# EAGLE design yarns_v03 (EAGLE 7.7.0)

## Sheet 1 of 3
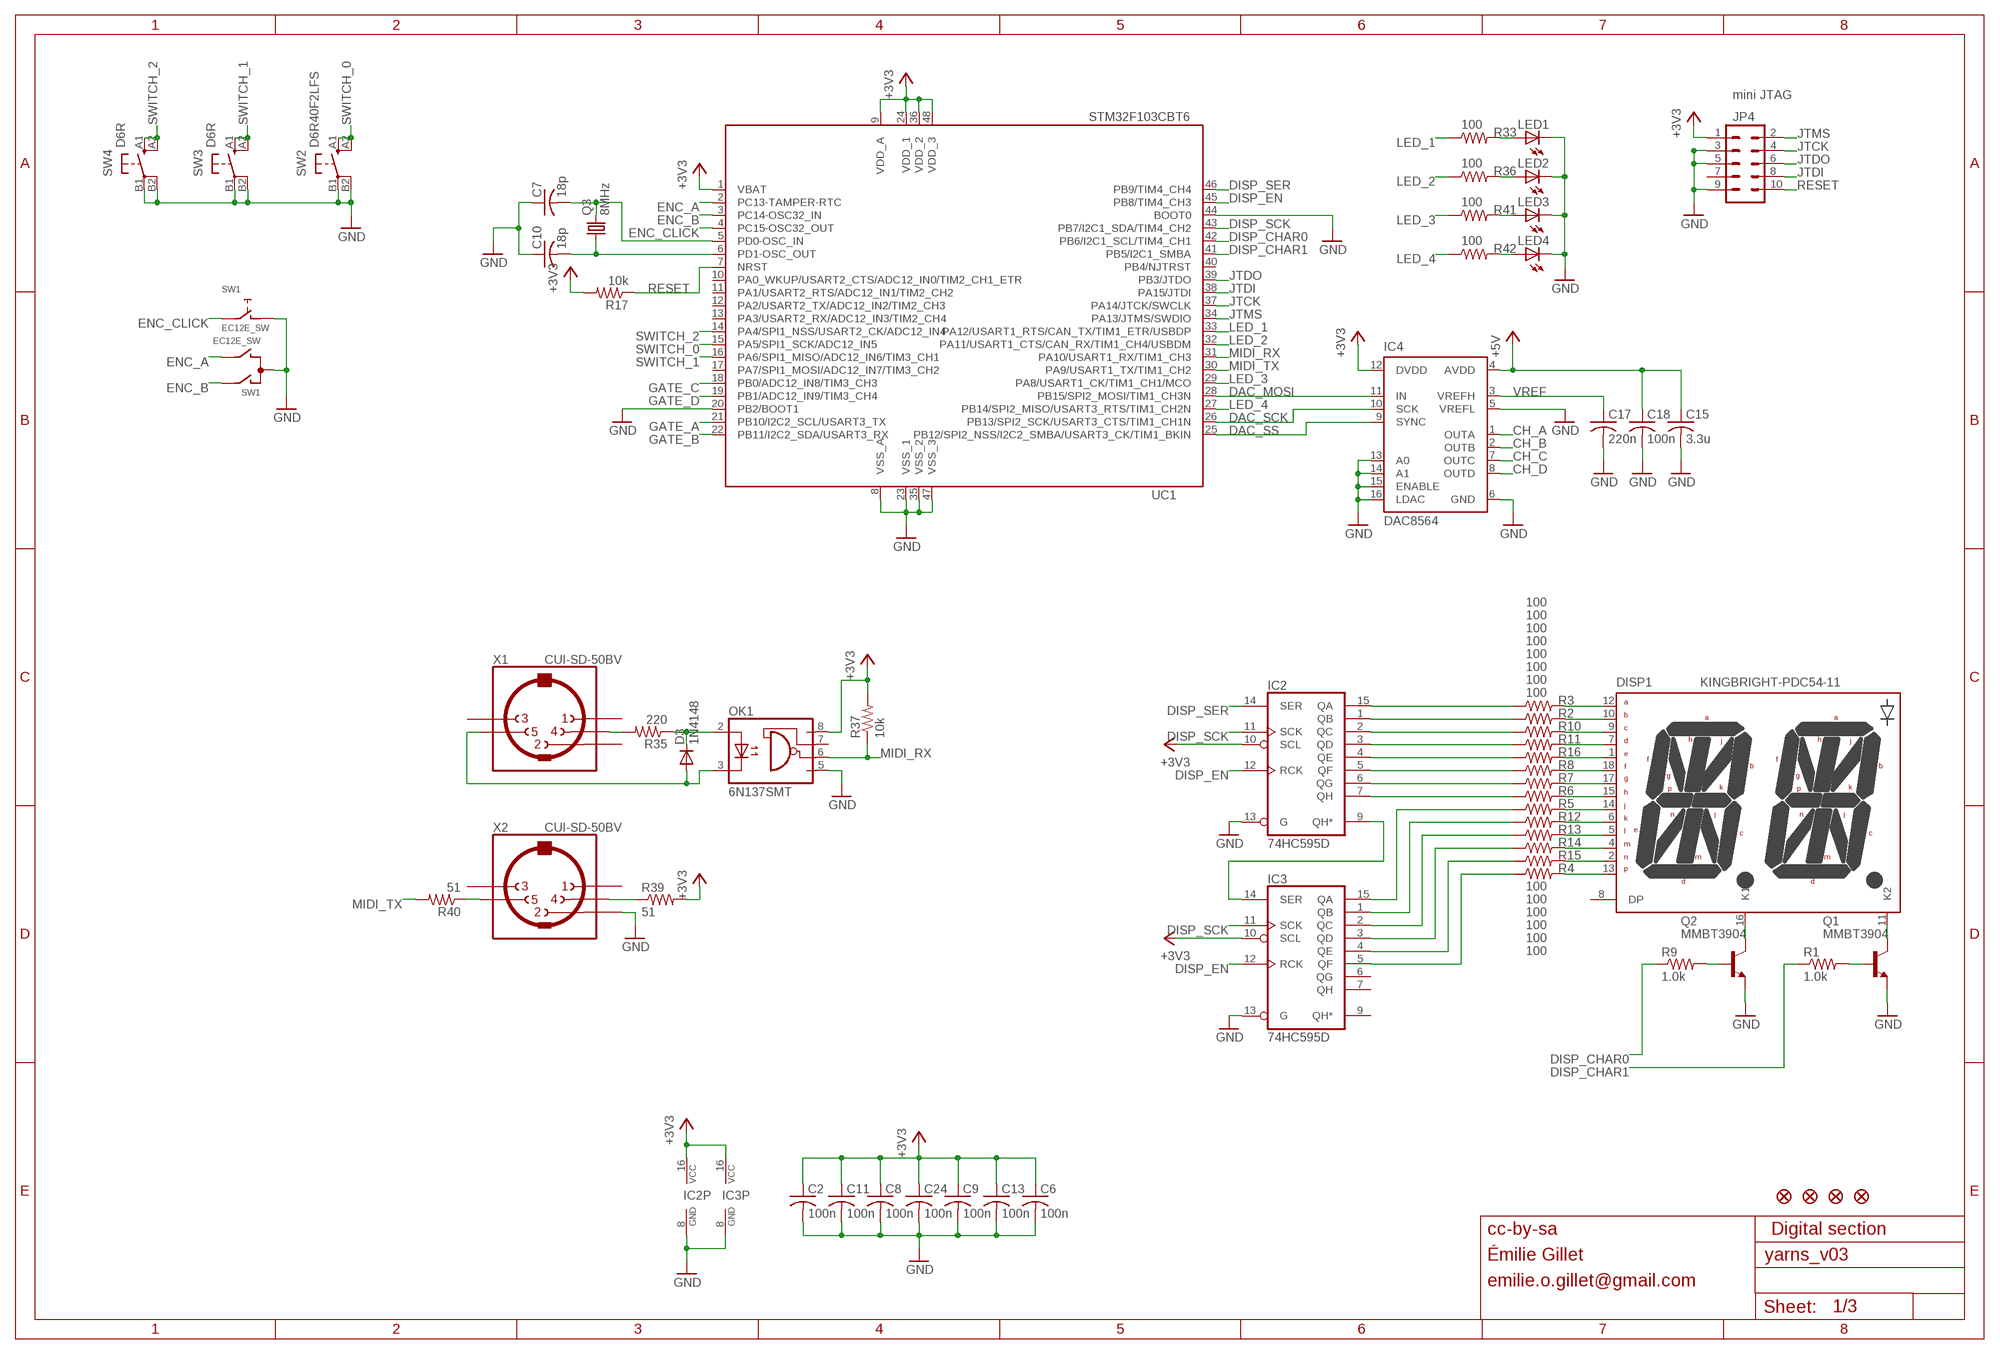
[diagram p0: schematic, sheet 1]

### Parts
C2  100n  C-USC0603  [C0603]
C6  100n  C-USC0603  [C0603]
C7  18p  C-USC0603  [C0603]
C8  100n  C-USC0603  [C0603]
C9  100n  C-USC0603  [C0603]
C10  18p  C-USC0603  [C0603]
C11  100n  C-USC0603  [C0603]
C13  100n  C-USC0603  [C0603]
C15  3.3u  C-USC0603  [C0603]
C17  220n  C-USC0603  [C0603]
C18  100n  C-USC0603  [C0603]
C24  100n  C-USC0603  [C0603]
D3  1N4148  DIODE-SOD323-W  [SOD323-W]
DISP1  KINGBRIGHT-PDC54-11  [PDC54]
F1  FIDUCIAL1X2  [FIDUCIAL-1X2]
F3  FIDUCIAL1X2  [FIDUCIAL-1X2]
F5  FIDUCIAL1X2  [FIDUCIAL-1X2]
F6  FIDUCIAL1X2  [FIDUCIAL-1X2]
IC2  74HC595D  [SO16]
IC3  74HC595D  [SO16]
IC4  DAC8564  [SOP65P640X110-16N]
JP4  M05X2MINIJTAG  [2X5-1.27]
LED1  LED3MM  [LED3MM]
LED2  LED3MM  [LED3MM]
LED3  LED3MM  [LED3MM]
LED4  LED3MM  [LED3MM]
OK1  6N137SMT  [DIL8-SMD]
Q1  MMBT3904  MMBT3904LT1-NPN-SOT23-BEC  [SOT23-BEC]
Q2  MMBT3904  MMBT3904LT1-NPN-SOT23-BEC  [SOT23-BEC]
Q3  8MHz  CRYSTALHC49UP  [HC49UP]
R1  1.0k  R-US_R0603  [R0603]
R2  100  R-US_R0603  [R0603]
R3  100  R-US_R0603  [R0603]
R4  100  R-US_R0603  [R0603]
R5  100  R-US_R0603  [R0603]
R6  100  R-US_R0603  [R0603]
R7  100  R-US_R0603  [R0603]
R8  100  R-US_R0603  [R0603]
R9  1.0k  R-US_R0603  [R0603]
R10  100  R-US_R0603  [R0603]
R11  100  R-US_R0603  [R0603]
R12  100  R-US_R0603  [R0603]
R13  100  R-US_R0603  [R0603]
R14  100  R-US_R0603  [R0603]
R15  100  R-US_R0603  [R0603]
R16  100  R-US_R0603  [R0603]
R17  10k  R-US_R0603  [R0603]
R33  100  R-US_R0603  [R0603]
R35  220  R-US_R0603  [R0603]
R36  100  R-US_R0603  [R0603]
R37  10k  R-US_R0603  [R0603]
R39  51  R-US_R0603  [R0603]
R40  51  R-US_R0603  [R0603]
R41  100  R-US_R0603  [R0603]
R42  100  R-US_R0603  [R0603]
SW1  EC12E_SW  [ALPS_EC12E_SW]
SW2  D6R40F2LFS  D6R  [D6R]
SW3  D6R  [D6R]
SW4  D6R  [D6R]
UC1  STM32F103CBT6  STM32F103CB  [LQFP48]
X1  CUI-SD-50BV  MAB5SHCUI-SD-50BV  [SD-50BV]
X2  CUI-SD-50BV  MAB5SHCUI-SD-50BV  [SD-50BV]

### Nets
+3V3: C2.1 C6.1 C8.1 C9.1 C11.1 C13.1 C24.1 IC2.10(SCL) IC2.16(VCC) IC3.10(SCL) IC3.16(VCC) IC4.12(DVDD) JP4.1 OK1.8(VCC) R17.2 R37.2 R39.2 UC1.1(VBAT) UC1.9(VDD_A) UC1.24(VDD_1) UC1.36(VDD_2) UC1.48(VDD_3) ; also sheet 3
+5V: C15.1 C18.1 IC4.4(AVDD) ; also sheet 3
CH_A: IC4.1(OUTA) ; also sheet 2
CH_B: IC4.2(OUTB) ; also sheet 2
CH_C: IC4.7(OUTC) ; also sheet 2
CH_D: IC4.8(OUTD) ; also sheet 2
DAC_MOSI: IC4.11(IN) UC1.28(PB15/SPI2_MOSI/TIM1_CH3N)
DAC_SCK: IC4.10(SCK) UC1.26(PB13/SPI2_SCK/USART3_CTS/TIM1_CH1N)
DAC_SS: IC4.9(SYNC) UC1.25(PB12/SPI2_NSS/I2C2_SMBA/USART3_CK/TIM1_BKIN)
DISP_CHAR0: R9.1 UC1.42(PB6/I2C1_SCL/TIM4_CH1)
DISP_CHAR1: R1.1 UC1.41(PB5/I2C1_SMBA)
DISP_EN: IC2.12(RCK) IC3.12(RCK) UC1.45(PB8/TIM4_CH3)
DISP_SCK: IC2.11(SCK) IC3.11(SCK) UC1.43(PB7/I2C1_SDA/TIM4_CH2)
DISP_SER: IC2.14(SER) UC1.46(PB9/TIM4_CH4)
ENC_A: SW1.B UC1.2(PC13-TAMPER-RTC)
ENC_B: SW1.A UC1.3(PC14-OSC32_IN)
ENC_CLICK: SW1.E UC1.4(PC15-OSC32_OUT)
GATE_A: UC1.21(PB10/I2C2_SCL/USART3_TX) ; also sheet 2
GATE_B: UC1.22(PB11/I2C2_SDA/USART3_RX) ; also sheet 2
GATE_C: UC1.18(PB0/ADC12_IN8/TIM3_CH3) ; also sheet 2
GATE_D: UC1.19(PB1/ADC12_IN9/TIM3_CH4) ; also sheet 2
GND: C2.2 C6.2 C7.1 C8.2 C9.2 C10.1 C11.2 C13.2 C15.2 C17.2 C18.2 C24.2 IC2.8(GND) IC2.13(G) IC3.8(GND) IC3.13(G) IC4.5(VREFL) IC4.6(GND) IC4.13(A0) IC4.14(A1) IC4.15(ENABLE) IC4.16(LDAC) JP4.3 JP4.5 JP4.9 LED1.K(C) LED2.K(C) LED3.K(C) LED4.K(C) OK1.5(GND) Q1.E Q2.E SW1.C SW1.D SW2.B1(P) SW2.B2(P1) SW3.B1(P) SW3.B2(P1) SW4.B1(P) SW4.B2(P1) UC1.8(VSS_A) UC1.20(PB2/BOOT1) UC1.23(VSS_1) UC1.35(VSS_2) UC1.44(BOOT0) UC1.47(VSS_3) X2.2 ; also sheet 2,3
JTCK: JP4.4 UC1.37(PA14/JTCK/SWCLK)
JTDI: JP4.8 UC1.38(PA15/JTDI)
JTDO: JP4.6 UC1.39(PB3/JTDO)
JTMS: JP4.2 UC1.34(PA13/JTMS/SWDIO)
LED_1: R33.1 UC1.33(PA12/USART1_RTS/CAN_TX/TIM1_ETR/USBDP)
LED_2: R36.1 UC1.32(PA11/USART1_CTS/CAN_RX/TIM1_CH4/USBDM)
LED_3: R41.1 UC1.29(PA8/USART1_CK/TIM1_CH1/MCO)
LED_4: R42.1 UC1.27(PB14/SPI2_MISO/USART3_RTS/TIM1_CH2N)
MIDI_RX: OK1.6(VO) R37.1 UC1.31(PA10/USART1_RX/TIM1_CH3)
MIDI_TX: R40.2 UC1.30(PA9/USART1_TX/TIM1_CH2)
N$1: DISP1.16(K1) Q2.C
N$3: DISP1.11(K2) Q1.C
N$4: C7.2 Q3.2 UC1.5(PD0-OSC_IN)
N$5: C10.2 Q3.1 UC1.6(PD1-OSC_OUT)
N$6: Q2.B R9.2
N$7: Q1.B R1.2
N$8: D3.C OK1.2(A) R35.1
N$9: R35.2 X1.4
N$10: R40.1 X2.5
N$11: DISP1.17(G) R7.2
N$12: D3.A OK1.3(C) X1.5
N$13: R39.1 X2.4
N$15: DISP1.12(A) R3.2
N$16: DISP1.10(B) R2.2
N$17: DISP1.9(C) R10.2
N$18: DISP1.7(D) R11.2
N$19: DISP1.1(E) R16.2
N$20: DISP1.18(F) R8.2
N$22: DISP1.15(H) R6.2
N$23: DISP1.14(J) R5.2
N$24: DISP1.6(K) R12.2
N$25: DISP1.5(L) R13.2
N$26: DISP1.4(M) R14.2
N$27: DISP1.2(N) R15.2
N$28: DISP1.13(P) R4.2
N$30: IC2.7(QH) R6.1
N$31: IC2.9(QH*) IC3.14(SER)
N$32: IC2.15(QA) R3.1
N$33: IC2.1(QB) R2.1
N$34: IC2.2(QC) R10.1
N$35: IC2.3(QD) R11.1
N$36: IC2.4(QE) R16.1
N$37: IC2.5(QF) R8.1
N$38: IC2.6(QG) R7.1
N$39: IC3.15(QA) R5.1
N$40: IC3.1(QB) R12.1
N$41: IC3.2(QC) R13.1
N$42: IC3.3(QD) R14.1
N$43: IC3.4(QE) R15.1
N$44: IC3.5(QF) R4.1
N$54: LED1.A R33.2
N$65: LED2.A R36.2
N$66: LED3.A R41.2
N$67: LED4.A R42.2
RESET: JP4.10 R17.1 UC1.7(NRST)
SWITCH_0: SW2.A1(S) SW2.A2(S1) UC1.15(PA5/SPI1_SCK/ADC12_IN5)
SWITCH_1: SW3.A1(S) SW3.A2(S1) UC1.16(PA6/SPI1_MISO/ADC12_IN6/TIM3_CH1)
SWITCH_2: SW4.A1(S) SW4.A2(S1) UC1.14(PA4/SPI1_NSS/USART2_CK/ADC12_IN4)
VREF: C17.1 IC4.3(VREFH) ; also sheet 2
Unconnected: DISP1.8(DP) IC3.6(QG) IC3.7(QH) IC3.9(QH*) JP4.7 OK1.7(VE) SW1.GND1(G) SW1.GND2(G) UC1.10(PA0_WKUP/USART2_CTS/ADC12_IN0/TIM2_CH1_ETR) UC1.11(PA1/USART2_RTS/ADC12_IN1/TIM2_CH2) UC1.12(PA2/USART2_TX/ADC12_IN2/TIM2_CH3) UC1.13(PA3/USART2_RX/ADC12_IN3/TIM2_CH4) UC1.17(PA7/SPI1_MOSI/ADC12_IN7/TIM3_CH2) UC1.40(PB4/NJTRST) X1.1 X1.2 X1.3 X2.1 X2.3

### Notes on the sheet
- mini JTAG
- cc-by-sa | Digital section
- Émilie Gillet
- emilie.o.gillet@gmail.com

## Sheet 2 of 3
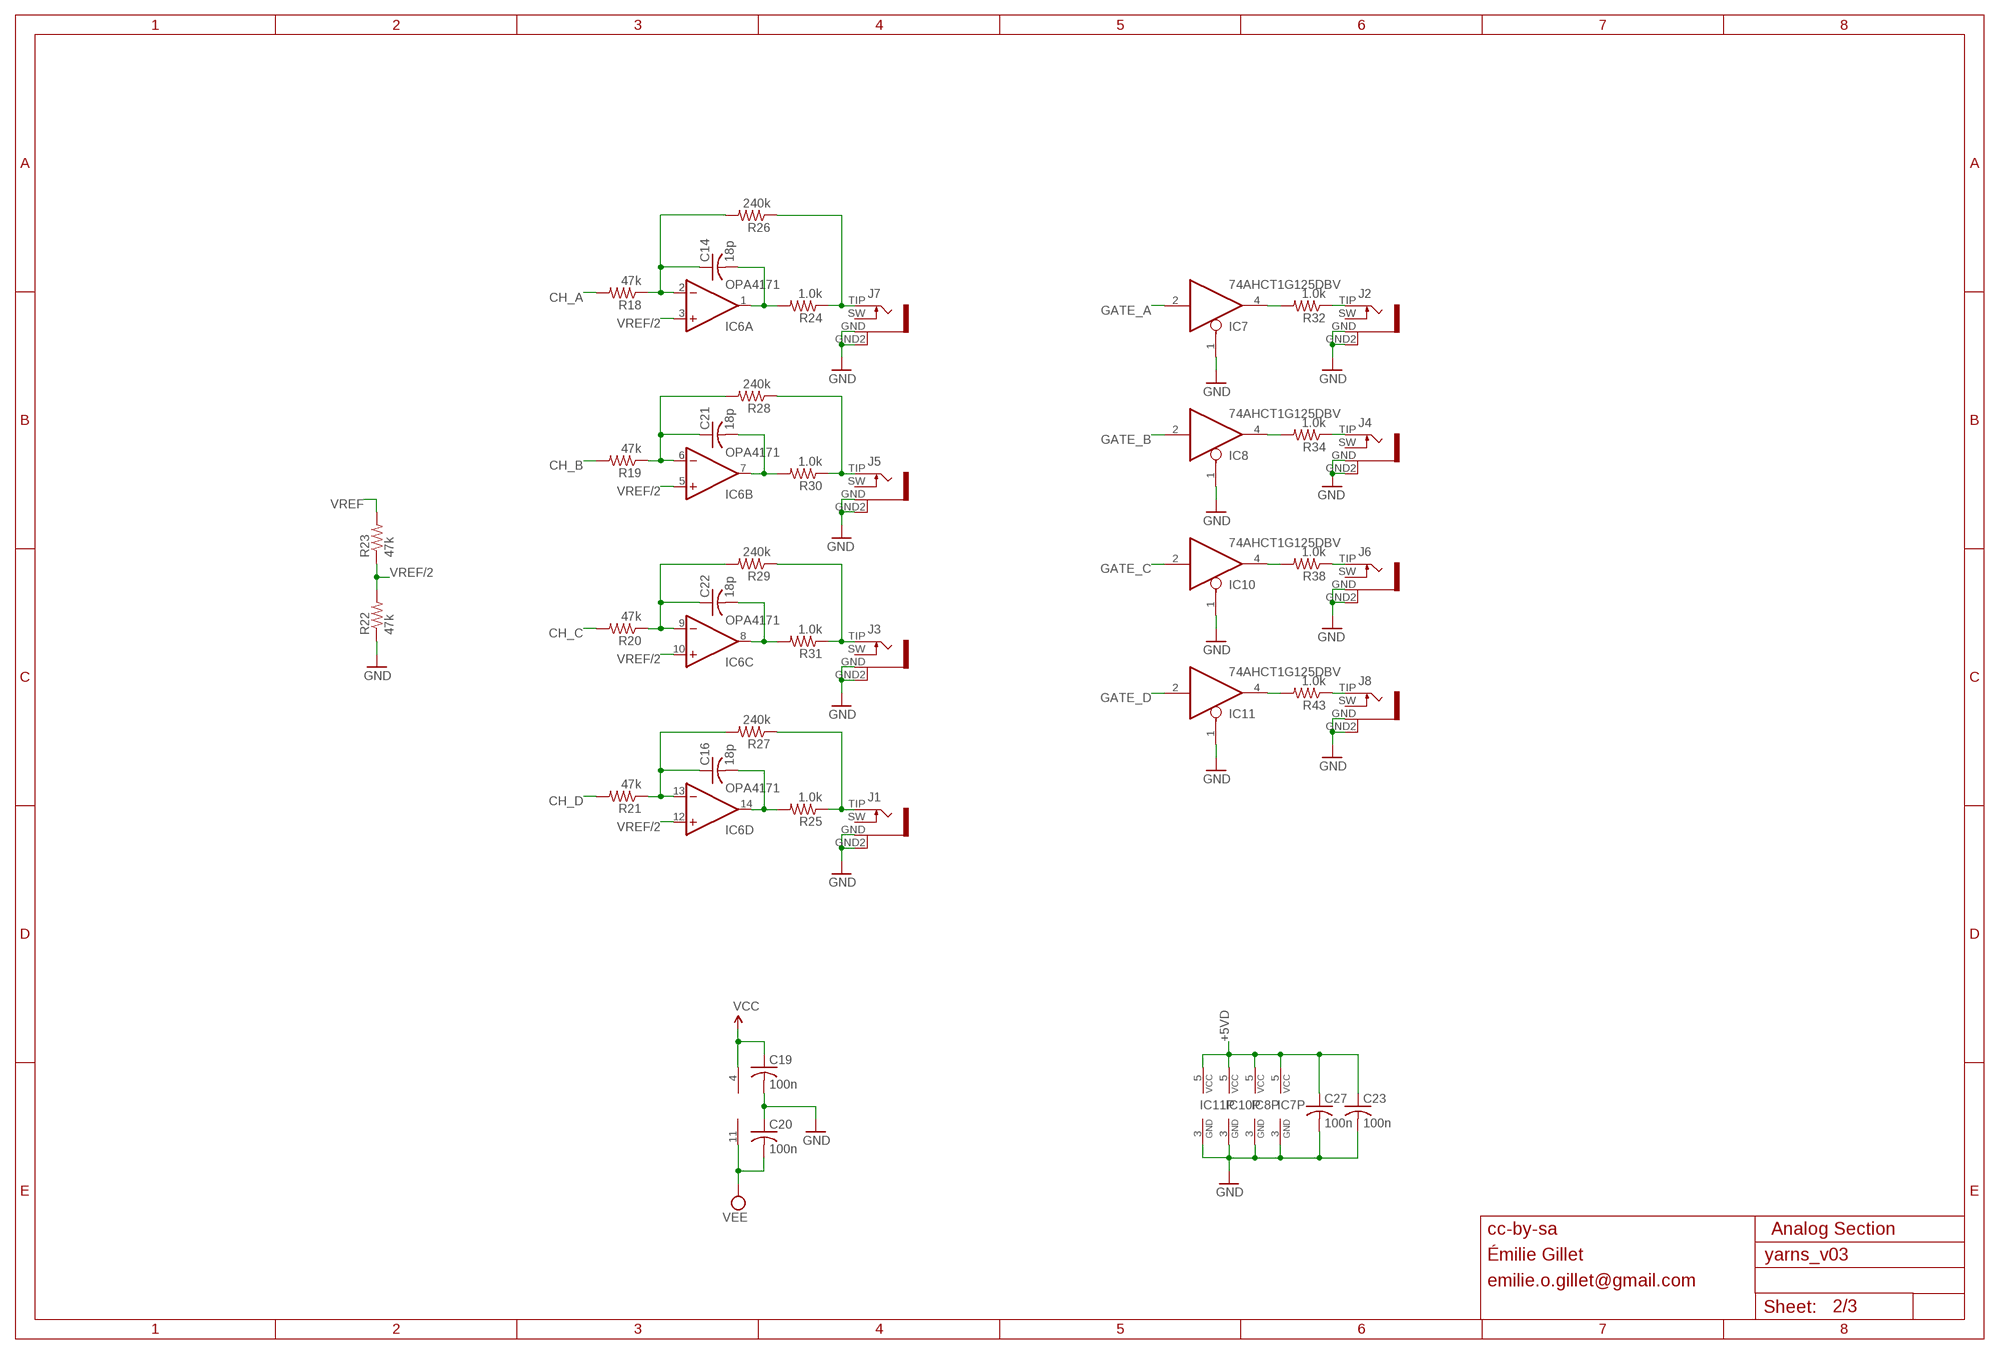
[diagram p1: schematic, sheet 2]

### Parts
C14  18p  C-USC0603  [C0603]
C16  18p  C-USC0603  [C0603]
C19  100n  C-USC0603  [C0603]
C20  100n  C-USC0603  [C0603]
C21  18p  C-USC0603  [C0603]
C22  18p  C-USC0603  [C0603]
C23  100n  C-USC0603  [C0603]
C27  100n  C-USC0603  [C0603]
IC6  OPA4171  TL074D  [SO14]
IC7  74AHCT1G125DBV  [SOT23-5]
IC8  74AHCT1G125DBV  [SOT23-5]
IC10  74AHCT1G125DBV  [SOT23-5]
IC11  74AHCT1G125DBV  [SOT23-5]
J1  PJ301WQP  [WQP_PJ_301BM]
J2  PJ301WQP  [WQP_PJ_301BM]
J3  PJ301WQP  [WQP_PJ_301BM]
J4  PJ301WQP  [WQP_PJ_301BM]
J5  PJ301WQP  [WQP_PJ_301BM]
J6  PJ301WQP  [WQP_PJ_301BM]
J7  PJ301WQP  [WQP_PJ_301BM]
J8  PJ301WQP  [WQP_PJ_301BM]
R18  47k  R-US_R0603  [R0603]
R19  47k  R-US_R0603  [R0603]
R20  47k  R-US_R0603  [R0603]
R21  47k  R-US_R0603  [R0603]
R22  47k  R-US_R0603  [R0603]
R23  47k  R-US_R0603  [R0603]
R24  1.0k  R-US_R0603  [R0603]
R25  1.0k  R-US_R0603  [R0603]
R26  240k  R-US_R0603  [R0603]
R27  240k  R-US_R0603  [R0603]
R28  240k  R-US_R0603  [R0603]
R29  240k  R-US_R0603  [R0603]
R30  1.0k  R-US_R0603  [R0603]
R31  1.0k  R-US_R0603  [R0603]
R32  1.0k  R-US_R0603  [R0603]
R34  1.0k  R-US_R0603  [R0603]
R38  1.0k  R-US_R0603  [R0603]
R43  1.0k  R-US_R0603  [R0603]

### Nets
+5VD: C23.1 C27.1 IC7.5(VCC) IC8.5(VCC) IC10.5(VCC) IC11.5(VCC) ; also sheet 3
AOUT: J2.TIP R32.1
CH_A: R18.2 ; also sheet 1
CH_B: R19.2 ; also sheet 1
CH_C: R20.2 ; also sheet 1
CH_D: R21.2 ; also sheet 1
GATE_A: IC7.2(I) ; also sheet 1
GATE_B: IC8.2(I) ; also sheet 1
GATE_C: IC10.2(I) ; also sheet 1
GATE_D: IC11.2(I) ; also sheet 1
GND: C19.2 C20.1 C23.2 C27.2 IC7.1(OE) IC7.3(GND) IC8.1(OE) IC8.3(GND) IC10.1(OE) IC10.3(GND) IC11.1(OE) IC11.3(GND) J1.GND J1.GND2 J2.GND J2.GND2 J3.GND J3.GND2 J4.GND J4.GND2 J5.GND J5.GND2 J6.GND J6.GND2 J7.GND J7.GND2 J8.GND J8.GND2 R22.1 ; also sheet 1,3
N$2: C22.1 IC6.9(C:-IN) R20.1 R29.2
N$14: IC7.4(O) R32.2
N$29: IC8.4(O) R34.2
N$45: IC10.4(O) R38.2
N$46: IC11.4(O) R43.2
N$47: C14.2 IC6.1(A:OUT) R24.2
N$48: J6.TIP R38.1
N$49: J8.TIP R43.1
N$50: C21.2 IC6.7(B:OUT) R30.2
N$51: C22.2 IC6.8(C:OUT) R31.2
N$52: C16.2 IC6.14(D:OUT) R25.2
N$53: J7.TIP R24.1 R26.1
N$55: J3.TIP R29.1 R31.1
N$57: J4.TIP R34.1
N$58: J1.TIP R25.1 R27.1
N$59: C16.1 IC6.13(D:-IN) R21.1 R27.2
N$60: C21.1 IC6.6(B:-IN) R19.1 R28.2
N$61: C14.1 IC6.2(A:-IN) R18.1 R26.2
N$63: J5.TIP R28.1 R30.1
VCC: C19.1 IC6.4(P:V+) ; also sheet 3
VEE: C20.2 IC6.11(P:V-) ; also sheet 3
VREF: R23.2 ; also sheet 1
VREF/2: IC6.3(A:+IN) IC6.5(B:+IN) IC6.10(C:+IN) IC6.12(D:+IN) R22.2 R23.1
Unconnected: J1.SW J2.SW J3.SW J4.SW J5.SW J6.SW J7.SW J8.SW

### Notes on the sheet
- cc-by-sa | Analog Section
- Émilie Gillet
- emilie.o.gillet@gmail.com

## Sheet 3 of 3
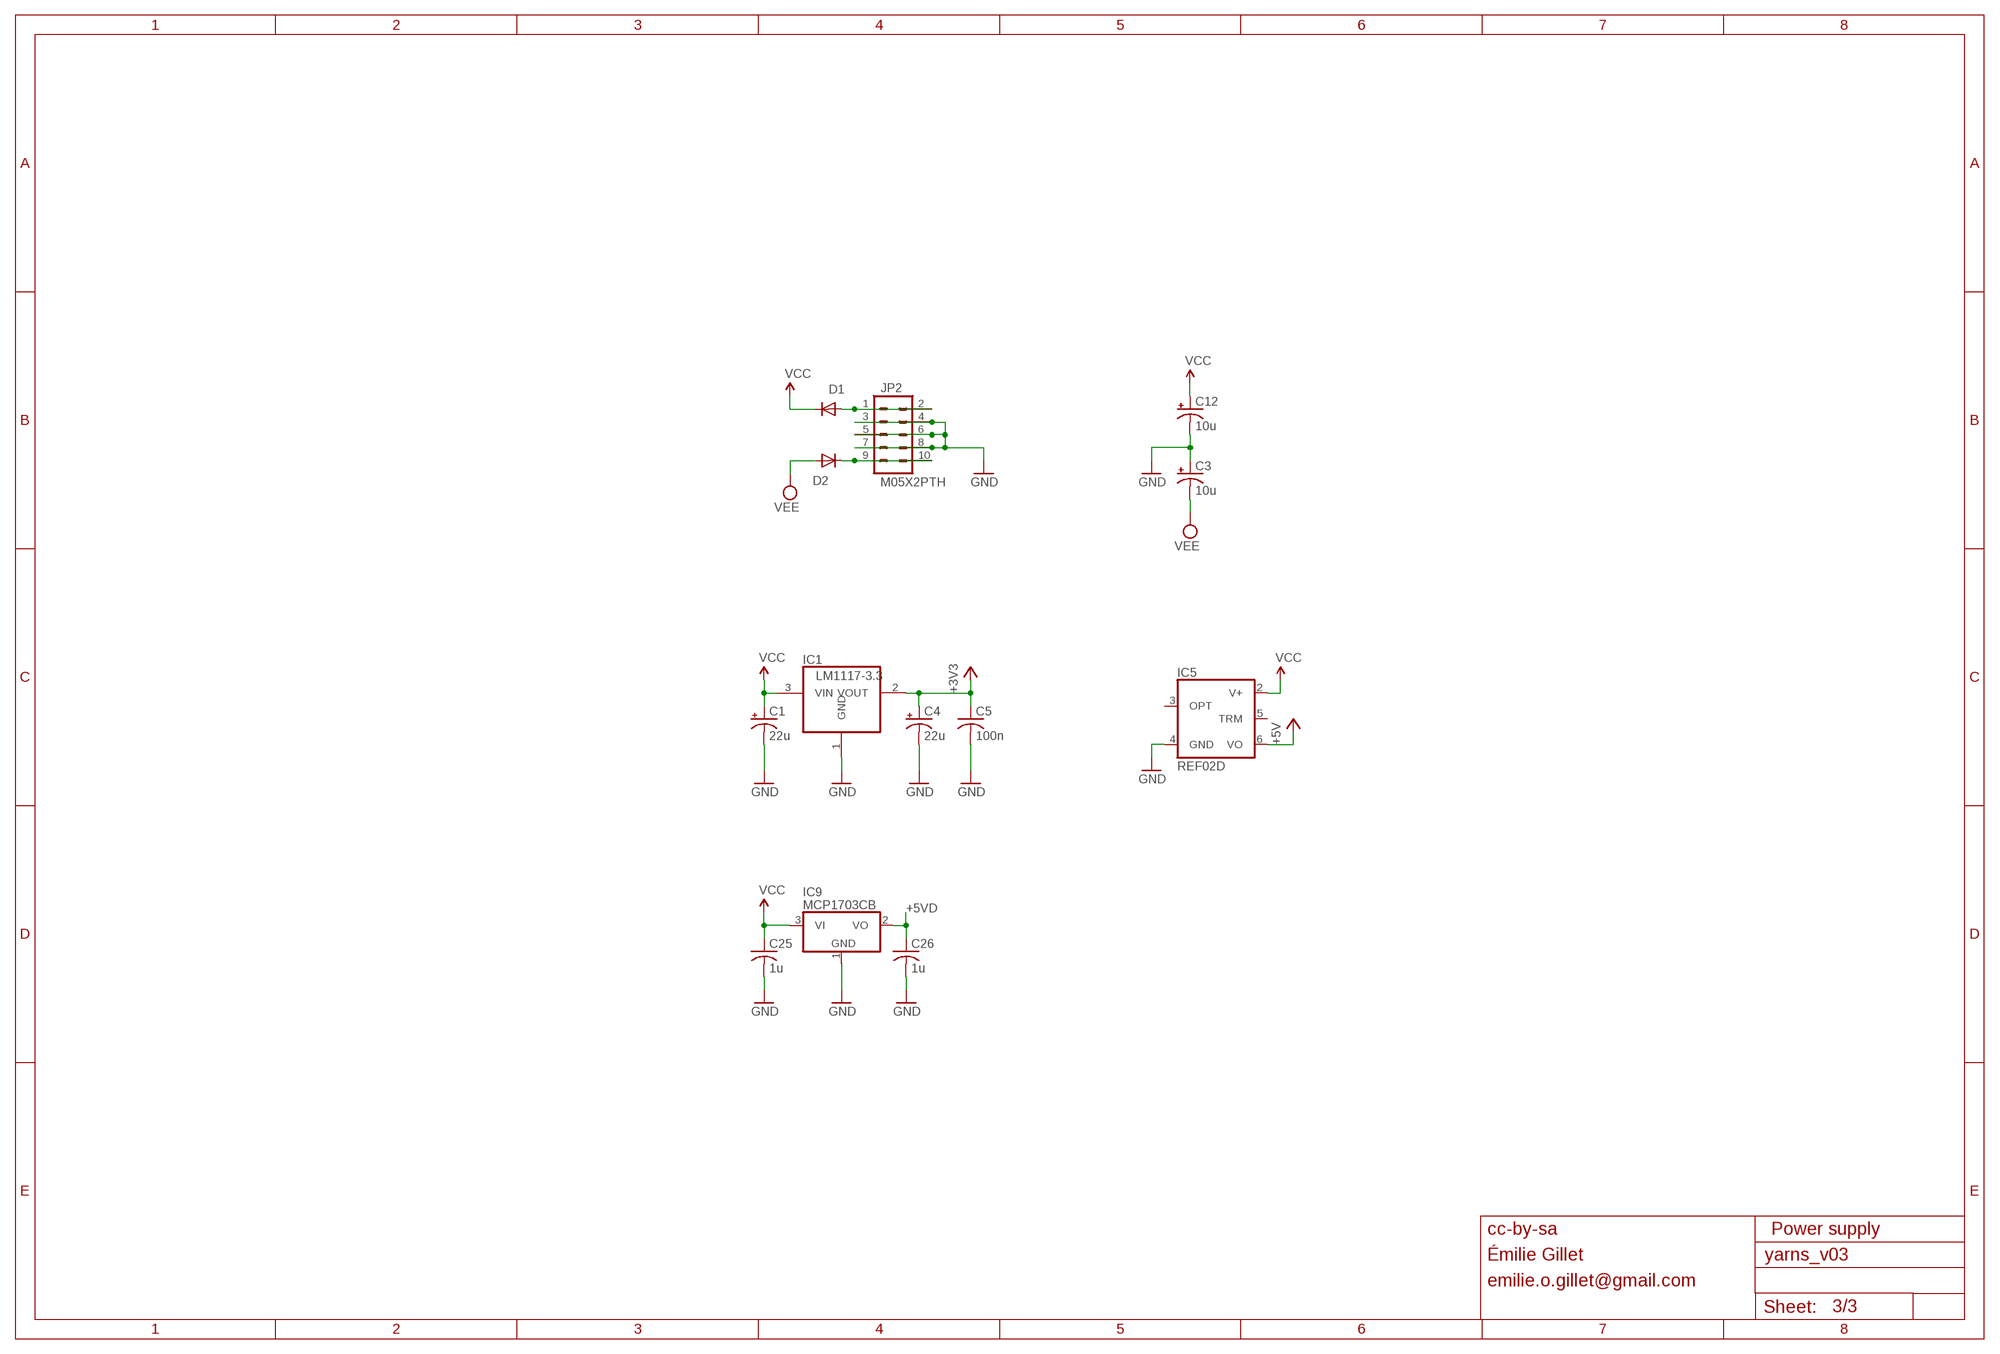
[diagram p2: schematic, sheet 3]

### Parts
C1  22u  CPOL-USC  [PANASONIC_C]
C3  10u  CPOL-USA  [PANASONIC_A]
C4  22u  CPOL-USC  [PANASONIC_C]
C5  100n  C-USC0603  [C0603]
C12  10u  CPOL-USA  [PANASONIC_A]
C25  1u  C-USC0603  [C0603]
C26  1u  C-USC0603  [C0603]
D1  1N5819HW  DIODE-SOD123  [SOD123]
D2  1N5819HW  DIODE-SOD123  [SOD123]
IC1  LM1117-3.3  REG1117  [SOT223]
IC5  REF02D  [SO08]
IC9  MCP1703CB  [SOT23]
JP2  M05X2PTH  [AVR_ICSP]

### Nets
+3V3: C4.+ C5.1 IC1.2(VOUT) ; also sheet 1
+5V: IC5.6(VO) ; also sheet 1
+5VD: C26.1 IC9.2(VO) ; also sheet 2
GND: C1.- C3.+ C4.- C5.2 C12.- C25.2 C26.2 IC1.1(GND) IC5.4(GND) IC9.1(GND) JP2.3 JP2.4 JP2.5 JP2.6 JP2.7 JP2.8 ; also sheet 1,2
N$56: D1.A JP2.1 JP2.2
N$64: D2.C JP2.9 JP2.10
VCC: C1.+ C12.+ C25.1 D1.C IC1.3(VIN) IC5.2(V+) IC9.3(VI) ; also sheet 2
VEE: C3.- D2.A ; also sheet 2
Unconnected: IC5.3(OPT) IC5.5(TRM)

### Notes on the sheet
- cc-by-sa | Power supply
- Émilie Gillet
- emilie.o.gillet@gmail.com

## Library data of the parts
C1 C3 C4 C12 = rcl:CPOL-US: POLARIZED CAPACITOR, American symbol
C2 C5-C11 C13-C27 = rcl:C-US: CAPACITOR, American symbol
D1-D3 = diode:DIODE-: DIODE
DISP1 = og-display:KINGBRIGHT-PDC54-11: Kingbright PDC54-11GWA ; also compatible with LITE-On LTP-3784G or Avago HDSP-A27C
F1 F3 F5 F6 = SparkFun:FIDUCIAL: Fiducial Alignment Points Various fiducial points for machine vision alignment.
IC1 = og-vreg:REG1117: 800mA and 1A Low Dropout (LDO) Positive Regulator 1.8V, 2.5V, 2.85V, 3.3V, 5V, and Adj
IC2 IC3 = 74xx-eu:74*595: 8-bit SHIFT REGISTER, output latch
IC4 = og-dac:DAC8564
IC5 = linear:REF02: VOLTAGE REFERENCE
IC6 = gm-ics:TL074: OP AMP
IC7 IC8 IC10 IC11 = 74xx-little-us:74*1G125: Single Bus Buffer Gate with 3-State Output
IC9 = linear:MCP1703: 250 mA, 16V, Low Quiescent Current LDO Regulator Source: http://ww1.microchip.com/downloads/en/DeviceDoc/22049b.pdf
J1-J8 = og-pj301:PJ301
JP2 JP4 = og-header:M05X2: Header 5x2 Standard 10-pin dual row 0.1" header. Commonly used with AVR-ISP. Use with Spark Fun Electronics SKU: PRT-00778
LED1-LED4 = led:LED: LED OSRAM: - CHIPLED LG R971, LG N971, LY N971, LG Q971, LY Q971, LO R971, LY R971 LH N974, LH R974 LS Q976, LO Q976, LY Q976 LO Q996 - Hyper CHIPLED LW Q18S LB Q993, LB Q99A, LB R99A - SideLED LS A670, LO A670, LY A670, LG A670, LP A670 LB A673, LV A673, LT A673, LW A673 LH A674 LY A675 LS A676, LA A676, LO A676, LY A676, LW A676 LS A679, LY A679, LG A679 - Hyper Micro SIDELED® LS Y876, LA Y876, LO Y876, LY Y876 LT Y87S - SmartLED LW L88C, LW L88S LB L89C, LB L89S, LG L890 LS L89K, LO L89K, LY L89K LS L896, LA L896, LO L896, LY L896 - TOPLED LS T670, LO T670, LY T670, LG T670, LP T670 LSG T670, LSP T670, LSY T670, LOP T670, LYG T670 LG T671, LOG T671, LSG T671 LB T673, LV T673, LT T673, LW T673 LH T674 LS T676, LA T676, LO T676, LY T676, LB T676, LH T676, LSB T676, LW T676 LB T67C, LV T67C, LT T67C, LS T67K, LO T67K, LY T67K, LW E67C LS E67B, LA E67B, LO E67B, LY E67B, LB E67C, LV E67C, LT E67C LW T67C LS T679, LY T679, LG T679 LS T770, LO T770, LY T770, LG T770, LP T770 LB T773, LV T773, LT T773, LW T773 LH T774 LS E675, LA E675, LY E675, LS T675 LS T776, LA T776, LO T776, LY T776, LB T776 LHGB T686 LT T68C, LB T68C - Hyper Mini TOPLED® LB M676 - Mini TOPLED Santana® LG M470 LS M47K, LO M47K, LY M47K Source: http://www.osram.convergy.de LUXEON: - LUMILED® LXK2-PW12-R00, LXK2-PW12-S00, LXK2-PW14-U00, LXK2-PW14-V00 LXK2-PM12-R00, LXK2-PM12-S00, LXK2-PM14-U00 LXK2-PE12-Q00, LXK2-PE12-R00, LXK2-PE12-S00, LXK2-PE14-T00, LXK2-PE14-U00 LXK2-PB12-K00, LXK2-PB12-L00, LXK2-PB12-M00, LXK2-PB14-N00, LXK2-PB14-P00, LXK2-PB14-Q00 LXK2-PR12-L00, LXK2-PR12-M00, LXK2-PR14-Q00, LXK2-PR14-R00 LXK2-PD12-Q00, LXK2-PD12-R00, LXK2-PD12-S00 LXK2-PH12-R00, LXK2-PH12-S00 LXK2-PL12-P00, LXK2-PL12-Q00, LXK2-PL12-R00 Source: www.luxeon.com KINGBRIGHT: KA-3528ASYC Source: www.kingbright.com
OK1 = og-optocouplers:6N137: MOTOROLA OPTO COUPLER
Q1 Q2 = transistor:*-NPN-: NPN Transistror BF959 corrected 2008.03.06
Q3 = crystal:CRYSTAL: CRYSTAL
R1-R43 = rcl:R-US_: RESISTOR, American symbol
SW1 = og-encoder:EC12E_SW: ALPS rotary Encoder EC12E series with switch
SW2-SW4 = og-switch:D6R: C&K D6R
UC1 = stm32:STM32F103CB
X1 X2 = og-midi:MAB5SH: Female CONNECTOR 5 pins 90 deg. with shield, horizontal (DIN 41524)

## Board
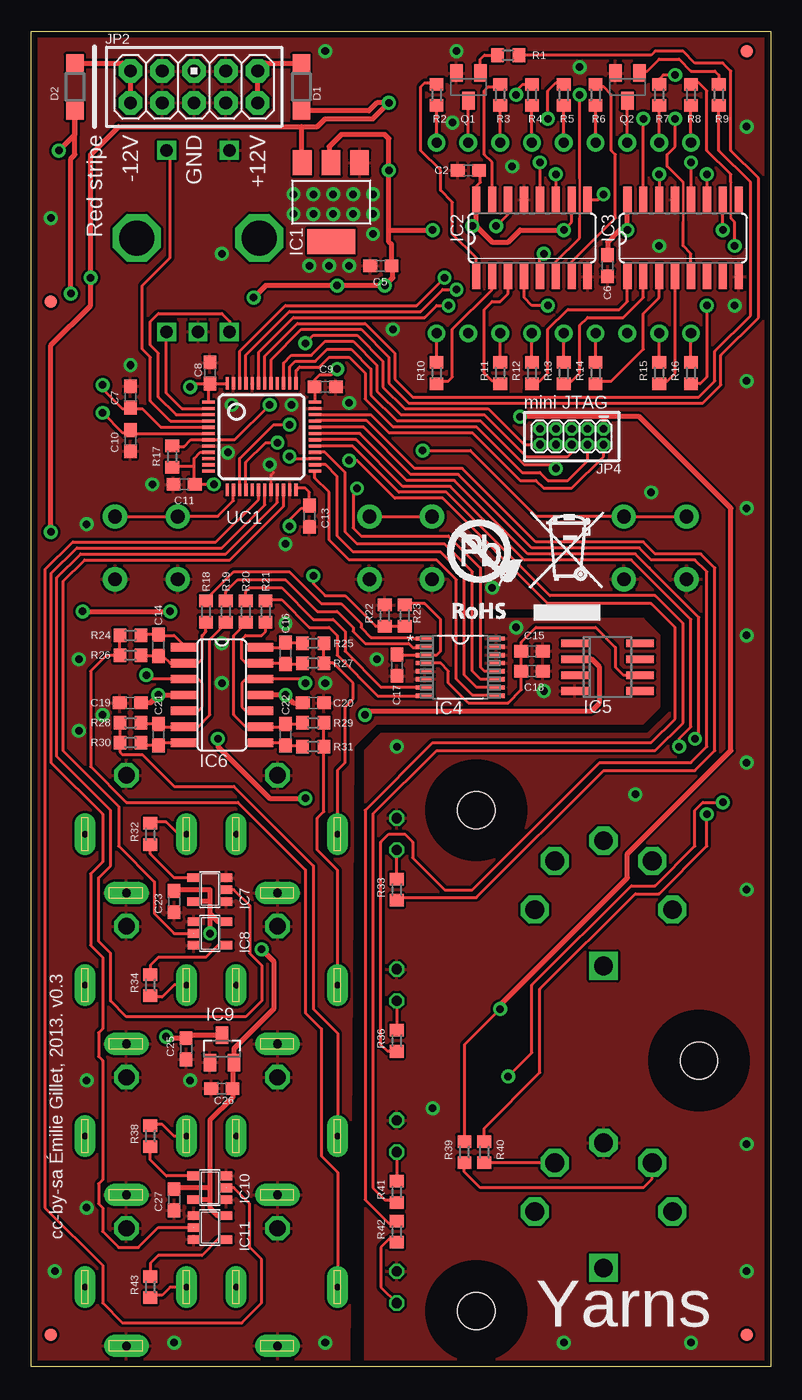
[diagram p3: board, top side]
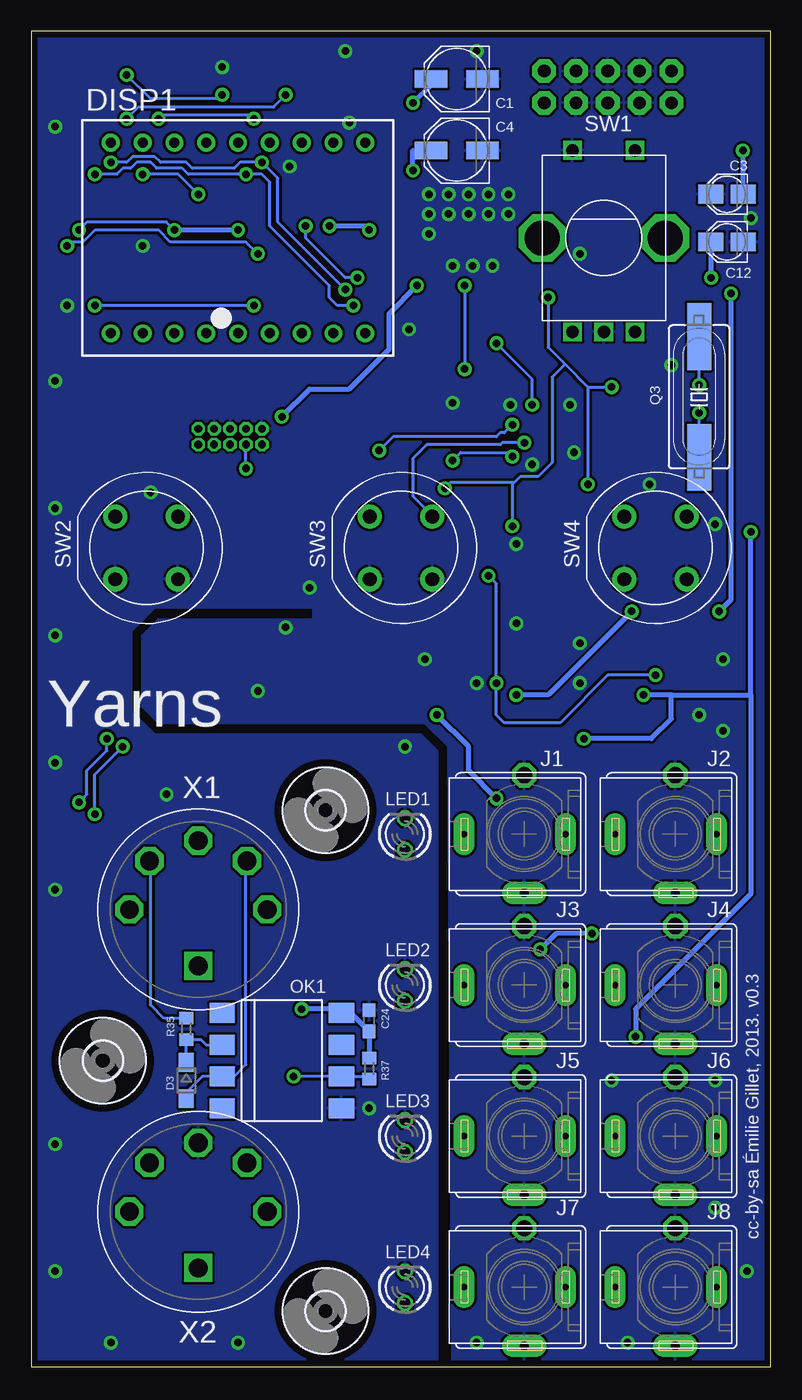
[diagram p4: board, bottom side, seen from below]

Size 59.03 x 106.68 mm. Coordinates in mm from the lower left corner, seen from the top.
Outline: 0,0 0,106.68 59.03,106.68 59.03,0 0,0
Copper layers (1*16): Top 0.035mm / dielectric 1.5mm / Bottom 0.035mm
Design rules "PCBCart-Standard": minimum track width 8mil, minimum drill 0.4mm, track to track 8mil, track to pad 8mil, pad to pad 8mil, via to via 8mil, smd to smd 8mil, copper to edge 20mil, drill to drill 8mil, minimum pad ring 8mil, minimum via ring 10mil, stop-mask expansion 3mil, vias tented up to drill 25mil, thermal gap 8mil

### Footprints (pad centres in the part's own frame; a part is rotated, then mirrored left to right if it is on the bottom)
PANASONIC_C = smd 2.6 x 1.4: + 2.05,0; - -2.05,0
C0603 = smd 1.1 x 1: 1 -0.85,0; 2 0.85,0
PANASONIC_A = smd 2 x 1.5: + 1.3,0; - -1.3,0
SOD123 = smd 1.4 x 1.4: A 1.9,0; C -1.9,0
SOD323-W = smd 1.5 x 1.2: A 1.45,0; C -1.45,0
PDC54 = drill 0.8 pad 1.422 round: 1 -10.16,-7.62; 2 -7.62,-7.62; 3 -5.08,-7.62; 4 -2.54,-7.62; 5 0,-7.62; 6 2.54,-7.62; 7 5.08,-7.62; 8 7.62,-7.62; 9 10.16,-7.62; 10 10.16,7.62; 11 7.62,7.62; 12 5.08,7.62; 13 2.54,7.62; 14 0,7.62; 15 -2.54,7.62; 16 -5.08,7.62; 17 -7.62,7.62; 18 -10.16,7.62
FIDUCIAL-1X2 = smd 1 x 1: 1 0,0
SOT223 = smd 1.499 x 2.007: 1 -2.261,-3.15; 2 0.025,-3.15; 3 2.311,-3.15 | smd 3.81 x 2.007: 4 0,3.15
SO16 = smd 0.66 x 2.032: 1 -4.445,-3.073; 2 -3.175,-3.073; 3 -1.905,-3.073; 4 -0.635,-3.073; 5 0.635,-3.073; 6 1.905,-3.073; 7 3.175,-3.073; 8 4.445,-3.073; 9 4.445,3.073; 10 3.175,3.073; 11 1.905,3.073; 12 0.635,3.073; 13 -0.635,3.073; 14 -1.905,3.073; 15 -3.175,3.073; 16 -4.445,3.073
SOP65P640X110-16N = smd 1.422 x 0.356: 1 -2.845,2.286; 2 -2.845,1.626; 3 -2.845,0.965; 4 -2.845,0.33; 5 -2.845,-0.33; 6 -2.845,-0.965; 7 -2.845,-1.626; 8 -2.845,-2.286; 9 2.845,-2.286; 10 2.845,-1.626; 11 2.845,-0.965; 12 2.845,-0.33; 13 2.845,0.33; 14 2.845,0.965; 15 2.845,1.626; 16 2.845,2.286
SO08 = smd 0.6 x 2.2: 1 -1.905,-2.6; 2 -0.635,-2.6; 3 0.635,-2.6; 4 1.905,-2.6; 5 1.905,2.6; 6 0.635,2.6; 7 -0.635,2.6; 8 -1.905,2.6
SO14 = smd 0.66 x 2.032: 1 -3.81,-3.073; 2 -2.54,-3.073; 3 -1.27,-3.073; 4 0,-3.073; 5 1.27,-3.073; 6 2.54,-3.073; 7 3.81,-3.073; 8 3.81,3.073; 9 2.54,3.073; 10 1.27,3.073; 11 0,3.073; 12 -1.27,3.073; 13 -2.54,3.073; 14 -3.81,3.073
SOT23-5 = smd 0.69 x 0.99: 1 -0.95,-1.29; 2 0,-1.29; 3 0.95,-1.29; 4 0.95,1.3; 5 -0.95,1.3
SOT23 = smd 1 x 1.4: 1 -0.95,-1.1; 2 0.95,-1.1; 3 0,1.1
WQP_PJ_301BM = drill 0.7 pad 1.778 long: GND -4.7,0 | drill 1.3 octagon: GND2 4.7,0 | drill 0.508 pad 1.676 long: SW 0,-3.3; TIP 0,4.8
AVR_ICSP = drill 1.016 pad 1.88 octagon: 1 -1.27,5.08; 2 1.27,5.08; 3 -1.27,2.54; 4 1.27,2.54; 5 -1.27,0; 6 1.27,0; 7 -1.27,-2.54; 8 1.27,-2.54; 9 -1.27,-5.08; 10 1.27,-5.08
2X5-1.27 = drill 0.61 pad 1.067 octagon: 1 -1.27,3.81; 2 0,3.81; 3 -1.27,2.54; 4 0,2.54; 5 -1.27,1.27; 6 0,1.27; 7 -1.27,0; 8 0,0; 9 -1.27,-1.27; 10 0,-1.27
LED3MM = drill 0.813 octagon: A -1.27,0; K 1.27,0
DIL8-SMD = smd 1.6 x 2: 1 -3.81,-4.77; 2 -1.27,-4.77; 3 1.27,-4.77; 4 3.81,-4.77; 5 3.81,4.77; 6 1.27,4.77; 7 -1.27,4.77; 8 -3.81,4.77
SOT23-BEC = smd 1 x 1.4: B -0.95,-1.1; C 0,1.1; E 0.95,-1.1
HC49UP = smd 5.334 x 1.93: 1 -4.826,0; 2 4.826,0
R0603 = smd 1 x 1.1: 1 -0.85,0; 2 0.85,0
ALPS_EC12E_SW = drill 1 square: A -2.5,-7.5; B 2.5,-7.5; C 0,-7.5; D -2.5,7; E 2.5,7 | drill 2.8 octagon: GND1 -4.9,0; GND2 4.9,0
D6R = drill 1.1 pad 1.93 round: A1 -2.5,2.5; A2 2.5,2.5; B1 -2.5,-2.5; B2 2.5,-2.5
3,0 = hole 3: 0,0
LQFP48 = smd 0.254 x 1: 1 -2.75,-4.25; 2 -2.25,-4.25; 3 -1.75,-4.25; 4 -1.25,-4.25; 5 -0.75,-4.25; 6 -0.25,-4.25; 7 0.25,-4.25; 8 0.75,-4.25; 9 1.25,-4.25; 10 1.75,-4.25; 11 2.25,-4.25; 12 2.75,-4.25; 25 2.75,4.25; 26 2.25,4.25; 27 1.75,4.25; 28 1.25,4.25; 29 0.75,4.25; 30 0.25,4.25; 31 -0.25,4.25; 32 -0.75,4.25; 33 -1.25,4.25; 34 -1.75,4.25; 35 -2.25,4.25; 36 -2.75,4.25 | smd 1 x 0.254: 13 4.25,-2.75; 14 4.25,-2.25; 15 4.25,-1.75; 16 4.25,-1.25; 17 4.25,-0.75; 18 4.25,-0.25; 19 4.25,0.25; 20 4.25,0.75; 21 4.25,1.25; 22 4.25,1.75; 23 4.25,2.25; 24 4.25,2.75; 37 -4.25,2.75; 38 -4.25,2.25; 39 -4.25,1.75; 40 -4.25,1.25; 41 -4.25,0.75; 42 -4.25,0.25; 43 -4.25,-0.25; 44 -4.25,-0.75; 45 -4.25,-1.25; 46 -4.25,-1.75; 47 -4.25,-2.25; 48 -4.25,-2.75
SD-50BV = drill 1.5 octagon: 1 -5.5,0; 2 0,5.5; 3 5.5,0; 4 -3.89,3.89; 5 3.89,3.89 | drill 1.5 square: P$3 0,-4.5

### Placement (x,y rotation side)
C1  25.06,102.87 180 bottom
C2  34.91,95.57 180 top
C3  3.47,93.66 180 bottom
C4  25.06,97.16 180 bottom
C5  27.92,87.95 180 top
C6  46.02,87.95 270 top
C7  7.92,77.47 270 top
C8  14.27,79.38 90 top
C9  23.47,78.26 0 top
C10  7.92,73.98 90 top
C11  12.2,70.49 180 top
C12  3.47,89.85 180 bottom
C13  22.2,67.94 270 top
C14  10.14,57.63 90 top
C15  39.98,57.15 0 top
C16  20.3,56.99 90 top
C17  29.19,56.04 270 top
C18  39.98,55.56 0 top
C19  7.92,53.02 180 top
C20  22.52,53.02 180 top
C21  10.14,50.48 270 top
C22  20.3,50.48 270 top
C23  11.41,37.15 270 top
C24  32.05,27.62 90 bottom
C25  12.36,25.4 270 top
C26  15.22,22.23 180 top
C27  11.41,13.34 270 top
D1  21.57,102.23 90 top
D2  3.47,102.23 270 top
D3  46.65,22.86 270 bottom
DISP1  42.52,90.17 0 bottom
F1  57.13,105.09 0 top
F3  1.57,85.09 0 top
F5  1.57,2.54 0 top
F6  57.13,2.54 0 top
IC1  23.95,93.03 180 top
IC2  39.98,90.17 0 top
IC3  52.05,90.17 0 top
IC4  34.27,55.88 0 top
IC5  46.02,55.88 270 top
IC6  15.22,53.66 270 top
IC7  14.27,38.1 90 top
IC8  14.27,34.61 270 top
IC9  15.22,25.4 0 top
IC10  14.27,14.29 90 top
IC11  14.27,11.11 270 top
J1  19.66,42.55 90 bottom
J2  7.6,42.55 90 bottom
J3  19.66,30.48 90 bottom
J4  7.6,30.48 90 bottom
J5  19.66,18.41 90 bottom
J6  7.6,18.41 90 bottom
J7  19.66,6.35 90 bottom
J8  7.6,6.35 90 bottom
JP2  13,102.23 270 top
JP4  41.89,73.66 270 top
LED1  29.19,42.55 90 bottom
LED2  29.19,30.48 90 bottom
LED3  29.19,18.41 90 bottom
LED4  29.19,6.35 90 bottom
OK1  39.03,24.45 270 bottom
Q1  34.91,102.23 180 top
Q2  47.6,102.23 180 top
Q3  5.69,77.47 90 bottom
R1  38.08,104.78 180 top
R2  32.36,101.6 270 top
R3  37.44,101.6 270 top
R4  39.98,101.6 270 top
R5  42.52,101.6 270 top
R6  45.06,101.6 270 top
R7  50.14,101.6 270 top
R8  52.68,101.6 270 top
R9  54.91,101.6 90 top
R10  32.36,79.38 90 top
R11  37.44,79.38 90 top
R12  39.98,79.38 90 top
R13  42.52,79.38 90 top
R14  45.06,79.38 90 top
R15  50.14,79.38 90 top
R16  52.68,79.38 90 top
R17  11.25,72.71 270 top
R18  13.95,60.33 90 top
R19  15.54,60.33 90 top
R20  17.12,60.33 90 top
R21  18.71,60.33 90 top
R22  28.24,60.01 270 top
R23  29.82,60.01 90 top
R24  7.92,58.42 0 top
R25  22.52,57.78 180 top
R26  7.92,56.83 0 top
R27  22.52,56.2 180 top
R28  7.92,51.44 0 top
R29  22.52,51.44 180 top
R30  7.92,49.85 0 top
R31  22.52,49.53 180 top
R32  9.5,42.55 270 top
R33  29.19,38.1 90 top
R34  9.5,30.48 90 top
R35  46.65,26.99 90 bottom
R36  29.19,26.04 90 top
R37  32.05,23.81 90 bottom
R38  9.5,18.41 270 top
R39  34.59,17.14 90 top
R40  36.17,17.14 90 top
R41  29.19,13.97 90 top
R42  29.19,10.79 270 top
R43  9.5,6.35 90 top
SW1  13.31,90.17 0 bottom
SW2  49.83,65.41 0 bottom
SW3  29.51,65.41 0 bottom
SW4  9.19,65.41 0 bottom
U$2  [3,0]  35.54,44.45 0 bottom
U$3  [3,0]  53.32,24.45 0 bottom
U$4  [3,0]  35.54,4.45 0 bottom
U$5  [ROHS]  32.36,59.05 0 top
UC1  18.39,74.3 270 top
X1  45.7,36.51 0 bottom
X2  45.7,12.38 0 bottom

### Tracks (layer width: path | path; a pad name or v marks a point on that pad's centre or on a via)
+3V3  (via drill 0.6)
  Top 0.254: C2.1 35.86,95.47 35.86,94.61 35.54,94.3 IC2.16 | v55.22,90.81 IC3.10 | v42.52,90.81 43.16,91.44 IC2.10 | C9.1 22.68,78.32 | v24.43,79.69 23.95,79.22 23,79.22 22.62,78.84 C9.1 | C9.1 22.64,78.24 UC1.36 | C8.1 14.14,78.4 UC1.1 | v12.68,78.26 12.94,78.53 C8.1 | UC1.48 15.62,78.53 C8.1 | 13,71.91 13,72.55 13.49,73.05 UC1.9 | R17.2 11.31,71.91 13,71.91 | C11.1 13,70.54 13,71.91 | C11.1 | v14.58,70.48 C11.1 | v20.62,67.15 20.62,67.63 21.57,68.58 21.99,68.58 C13.1 22.2,69.85 21.89,70.17 21.27,70.17 UC1.24 | IC4.12 37.1,55.56 36.17,55.56 35.86,55.88 35.86,63.82 33.32,66.36 26.33,66.36 25.7,66.99 25.7,69.85 v26.01,70.17 | R39.2 34.59,25.72 v37.44,28.57
  Top 0.406: 35.54,91.12 IC2.16 | v35.22,91.12 35.54,91.12 | 35.54,91.12 36.81,89.85 38.08,89.85 39.03,90.81 v42.52,90.81 | IC3.16 v47.6,90.81 46.97,90.81 46.02,89.85 C6.1 | 24.11,95.99 IC1.2 23.79,96.31 23.79,97.47 24.74,98.42 28.24,98.42 28.55,98.11 v28.55,95.57 28.55,90.81 | v17.76,85.41 18.71,86.36 v24.43,86.36 v28.24,86.36 28.87,87 28.87,87.84 C5.1 28.77,89.64 28.55,89.85 28.55,90.81 | 45.7,75.88 48.56,75.88 55.86,68.58 55.86,49.21 47.6,40.96 47.6,39.05 37.44,28.89 v37.44,28.57 | 45.7,75.88 v39.03,75.88 | 45.7,75.88 JP4.1 | 28.55,90.81 v32.05,90.81
  Bottom 0.254: v47.6,90.81 48.24,91.44 54.59,91.44 v55.22,90.81 | v24.43,86.36 v24.43,79.69 | v17.76,85.41 17.76,81.44 16.49,80.17 | 16.49,80.17 14.58,78.26 | 14.58,78.26 v12.68,78.26 | 14.58,78.26 v14.58,70.48 | v20.62,67.15 20.62,70.48 20.46,70.64 | 16.49,80.17 16.49,80.01 17.44,79.06 17.44,72.23 18.55,71.12 19.98,71.12 20.46,70.64 | v26.01,70.17 25.54,70.64 20.46,70.64
  Bottom 0.406: v42.52,90.81 v47.6,90.81 | v32.05,90.81 32.36,91.12 v35.22,91.12 | v28.24,86.36 30.46,84.14 30.46,81.28 33.63,78.11 36.81,78.11 v39.03,75.88 | R37.2 C24.1 33.53,28.26 OK1.8 34.58,28.57 v37.44,28.57 | C4.+ 28.55,97.16 v28.55,95.57
+5V
  Top 0.254: IC4.4 31.44,56.2 32.68,56.2 33.32,55.56 33.32,54.61 34.91,53.02 38.08,53.02 39.13,54.08 C18.1 C15.1 39.13,57.89 40.3,59.05 45.06,59.05 46.65,57.47 46.65,55.88 47.29,55.24 IC5.6
+5VD  (via drill 0.6)
  Top 0.406: IC10.5 13.63,13.34 13.64,13.34 14.27,13.34 | C27.1 11.51,14.29 14.27,14.29 | 14.27,14.29 14.27,19.68 16.07,21.49 C26.1 16.07,24.2 IC9.2 16.17,25.4 19.35,28.57 19.35,32.38 v18.39,33.34 | 14.27,14.29 14.27,13.34 | 14.27,13.34 14.27,12.7 14.9,12.06 IC11.5 | 14.27,37.15 14.27,38.1 11.51,38.1 C23.1 | IC7.5 14.26,37.15 14.27,37.15 | 14.27,37.15 14.27,36.2 | 14.27,36.2 14.9,35.56 IC8.5 | 14.27,36.2 v14.27,34.61
  Bottom 0.406: v18.39,33.34 17.12,34.61 v14.27,34.61
AOUT
  Top 0.254: R32.1 9.61,43.5 10.77,43.5 11.73,42.55 J2.TIP
CH_A
  Top 0.254: 31.36,58.1 IC4.1 30.55,58.17 30.46,58.26 27.13,58.26 26.33,59.05 26.33,59.37 24.74,60.96 23.16,60.96 20.62,63.5 16.17,63.5 13.95,61.28 R18.2
CH_B
  Top 0.254: IC4.2 31.39,57.47 30.46,57.47 30.14,57.78 26.65,57.78 25.7,58.74 25.7,59.05 24.43,60.33 22.84,60.33 20.3,62.87 16.49,62.87 15.54,61.91 R19.2
CH_C
  Top 0.254: IC4.7 31.39,54.29 27.92,54.29 25.06,57.15 25.06,58.74 24.11,59.69 22.52,59.69 19.98,62.23 17.44,62.23 17.12,61.91 R20.2
CH_D
  Top 0.254: R21.2 18.81,61.28 19.98,61.28 22.2,59.05 23.79,59.05 24.43,58.42 24.43,56.83 27.67,53.59 IC4.8
DAC_MOSI
  Top 0.254: IC4.11 37.1,54.93 35.86,54.93 35.22,55.56 35.22,63.5 33,65.72 26.01,65.72 25.06,66.67 25.06,71.44 23.45,73.05 UC1.28
DAC_SCK
  Top 0.254: IC4.10 37.08,54.29 35.54,54.29 34.59,55.24 34.59,63.18 32.68,65.09 25.7,65.09 24.43,66.36 24.43,71.12 23.5,72.05 UC1.26
DAC_SS
  Top 0.254: IC4.9 37.05,53.66 35.22,53.66 33.95,54.93 33.95,62.87 32.36,64.45 25.38,64.45 23.79,66.04 23.79,69.85 22.64,71 UC1.25
DISP_CHAR0
  Top 0.254: R9.1 54.91,97.16 57.45,94.61 57.45,83.98 54.59,81.12 54.59,78.74 53.32,77.47 30.46,77.47 29.03,78.9 29.03,80.96 26.65,83.34 21.25,83.34 18.64,80.74 UC1.42
DISP_CHAR1
  Top 0.254: R1.1 49.51,104.78 49.83,105.09 52.05,105.09 53,104.14 55.22,104.14 55.86,103.5 55.86,97.16 58.08,94.93 58.08,83.82 55.07,80.8 55.07,78.42 53.64,76.99 30.14,76.99 28.55,78.58 28.55,80.64 26.33,82.87 21.57,82.87 19.14,80.44 UC1.41
DISP_EN  (via drill 0.6)
  Top 0.254: v40.62,96.2 IC2.12 | v52.68,96.2 IC3.12 | v33.95,86.04 32.84,86.04 31.09,84.3 20.62,84.3 17.14,80.82 UC1.45
  Bottom 0.254: v52.68,96.2 51.41,96.2 50.94,96.68 49.19,96.68 48.72,96.2 46.65,96.2 46.18,95.73 42.84,95.73 42.37,96.2 v40.62,96.2 39.35,94.93 39.35,91.44 v33.95,86.04
DISP_SCK  (via drill 0.6)
  Top 0.254: v33.32,84.77 32.36,84.77 31.41,83.82 20.93,83.82 18.14,81.03 UC1.43 | v53.95,95.25 IC3.11 | v41.89,95.25 IC2.11
  Bottom 0.254: v53.95,95.25 52.21,95.25 51.73,95.73 51.1,95.73 50.62,96.2 49.51,96.2 49.03,95.73 46.97,95.73 46.49,95.25 v41.89,95.25 40.62,95.25 39.98,94.61 39.98,91.12 35.22,86.36 35.22,85.41 34.59,84.77 v33.32,84.77
DISP_SER  (via drill 0.6)
  Top 0.254: IC2.14 38.08,92.08 v37.13,91.12 | v33,87 30.78,84.77 20.3,84.77 16.64,81.12 UC1.46
  Bottom 0.254: v33,87 33.95,87 37.13,90.17 v37.13,91.12
ENC_A
  Top 0.254: SW1.B 10.77,82.63 10.77,77.79 12.02,76.55 UC1.2
ENC_B
  Top 0.254: SW1.A 15.85,82.71 15.85,83.5 15.22,84.14 10.14,84.14 9.5,83.5 9.5,81.6 10.14,80.96 10.14,77.47 11.56,76.05 UC1.3
ENC_CLICK
  Top 0.254: 14.12,75.56 UC1.4 11.11,75.55 9.5,77.15 9.5,80.64 8.87,81.28 8.87,86.36 11.09,88.58 11.09,96.89 SW1.E
GATE_A
  Top 0.254: UC1.21 19.64,69.04 15.54,64.93 3.95,64.93 2.04,63.02 2.04,48.74 6.33,44.45 6.33,40.01 5.38,39.05 5.38,33.97 6.33,33.02 6.33,29.21 7.6,27.94 17.12,27.94 18.39,29.21 18.39,32.07 17.44,33.02 17.44,36.83 16.17,38.1 IC7.2
GATE_B
  Top 0.254: UC1.22 20.14,68.74 15.85,64.45 4.27,64.45 2.52,62.71 2.52,49.21 6.96,44.77 6.96,41.59 9.82,38.73 9.82,36.2 11.41,34.61 IC8.2
GATE_C
  Top 0.254: UC1.18 18.14,69.28 14.74,65.88 3.31,65.88 1.09,63.66 1.09,12.7 5.69,8.1 5.69,5.08 7.28,3.49 16.81,3.49 18.39,5.08 18.39,8.57 17.44,9.53 17.44,13.02 16.17,14.29 IC10.2
GATE_D
  Top 0.254: UC1.19 18.64,68.83 15.22,65.41 3.63,65.41 1.57,63.34 1.57,48.26 5.69,44.13 5.69,40.32 4.74,39.37 4.74,33.66 5.69,32.7 5.69,26.99 5.38,26.67 5.38,24.77 5.69,24.45 5.69,14.92 5.38,14.61 5.38,13.02 5.69,12.7 5.69,10.79 6.96,9.53 8.55,9.53 10.14,11.11 IC11.2
GND  (via drill 0.6)
  Top 0.254: 19.35,71.44 19.14,71.23 UC1.20
  other vias: 5.69,52.07 23.47,54.61 38.4,95.89 50.14,89.53 43.79,103.82 33.95,105.09 56.18,84.77 7.92,80.01 27.6,56.52 1.57,91.76 15.22,88.9 20.3,65.72 19.03,72.07 12.68,22.86 40.94,53.98 15.7,73.03 57.13,99.06 11.41,1.91 23.47,1.91 4.42,12.7 4.42,22.86 23.47,105.09 20.78,76.83 25.38,76.99 9.66,70.48 16.01,76.83 28.87,82.87 38.71,59.05 57.13,78.74 57.13,68.58 57.13,58.42 57.13,48.26 57.13,38.1 57.13,17.78 57.13,7.62 52.68,1.91 42.52,1.91 1.88,7.62 32.05,20.64 27.28,90.49 36.81,62.23 33.63,99.38 48.24,45.72 49.51,69.85 4.42,67.31 15.22,57.78 15.22,54.61 20.3,59.37 3.79,50.8 3.79,56.52 29.19,49.53 25.38,87.95 23.79,87.95 22.2,87.95 20.93,93.66 22.52,93.66 20.93,92.08 22.52,92.08 24.11,92.08 25.7,93.66 24.11,93.66 25.7,92.08 27.28,92.08 27.28,93.66
  pour Top: -0.02,106.68 -0.02,0 25.38,0 25.7,49.53 27.6,51.44 48.88,51.44 50.14,52.7 50.14,58.42 48.88,59.69 36.49,59.69 36.49,60.64 49.19,60.64 51.1,58.74 51.1,52.39 49.19,50.48 27.92,50.48 26.65,49.21 26.65,0 59.03,0 59.03,106.68
  pour Bottom: -0.02,106.68 -0.02,0 25.38,0 25.7,49.53 27.6,51.44 48.88,51.44 50.14,52.7 50.14,58.42 48.88,59.69 36.49,59.69 36.49,60.64 49.19,60.64 51.1,58.74 51.1,52.39 49.19,50.48 27.92,50.48 26.65,49.21 26.65,0 59.03,0 59.03,106.68
JTCK
  Top 0.254: JP4.4 44.43,72.39 42.84,70.8 41.25,70.8 40.62,71.44 39.19,71.44 35.54,75.09 28.87,75.09 26.65,77.31 26.65,79.38 25.38,80.64 23.79,80.64 23,79.85 21.41,79.85 21.14,79.58 UC1.37
JTDI  (via drill 0.6)
  Top 0.254: v41.89,71.75 41.57,72.07 39.35,72.07 35.86,75.56 29.19,75.56 27.13,77.63 27.13,79.69 25.54,81.28 23.63,81.28 22.68,80.33 21.09,80.33 20.64,79.88 | UC1.38 20.64,79.88 | 20.64,79.88
  Bottom 0.254: v41.89,71.75 JP4.8
JTDO
  Top 0.254: JP4.6 43.16,73.03 42.84,72.71 39.51,72.71 36.17,76.04 29.51,76.04 27.6,77.95 27.6,80.01 25.7,81.92 23.47,81.92 22.36,80.8 20.78,80.8 20.14,80.17 UC1.39
JTMS
  Top 0.254: JP4.2 45.7,72.71 43.16,70.17 40.94,70.17 40.3,70.8 39.03,70.8 35.22,74.61 28.55,74.61 27.12,76.05 UC1.34
LED_1
  Top 0.254: 29.09,37.15 R33.1 29.4,37.47 35.54,37.47 45.7,47.62 53,47.62 54.59,49.21 54.59,63.82 53.48,64.93 49.83,64.93 48.88,65.88 40.3,65.88 | UC1.33 22.66,75.56 26.81,75.56 30.62,71.75 34.43,71.75 40.3,65.88 | 40.3,65.88
LED_2
  Top 0.254: UC1.32 26.53,75.05 30.3,71.28 34.11,71.28 39.98,65.41 48.56,65.41 49.51,64.45 53,64.45 53.95,63.5 53.95,49.53 52.68,48.26 45.38,48.26 35.22,38.1 33,38.1 30.46,40.64 30.46,41.91 29.82,42.55 28.55,42.55 27.92,41.91 27.92,25.72 28.45,25.18 R36.1
LED_3
  Top 0.254: R41.1 28.97,13.34 28.24,13.34 27.28,14.29 27.28,44.13 32.36,49.21 49.83,49.21 52.05,51.44 52.05,59.37 49.83,61.59 41.41,61.59 33.16,69.85 29.35,69.85 25.65,73.55 UC1.29
LED_4  (via drill 0.6)
  Top 0.254: R42.1 28.97,11.43 28.55,11.43 26.65,13.34 26.65,44.45 32.05,49.85 49.51,49.85 51.41,51.75 51.41,59.05 49.51,60.96 41.25,60.96 32.84,69.37 29.03,69.37 26.01,72.39 v25.38,72.39 | v20.62,72.71 20.78,72.55 UC1.27
  Bottom 0.254: v25.38,72.39 24.74,73.03 20.93,73.03 v20.62,72.71
MIDI_RX  (via drill 0.6)
  Top 0.254: 49.35,63.82 48.24,64.93 39.67,64.93 33.79,70.8 29.98,70.8 26.24,74.55 UC1.31 | 49.35,63.82 | 49.35,63.82 53.32,59.85 53.32,50.48 v53,50.16 | v55.22,45.09 53.64,45.09 53,44.45 53,41.59 49.83,38.42 47.92,38.42 39.98,30.48 39.98,25.08 v38.08,23.18
  Bottom 0.254: v55.22,45.09 54.59,45.72 54.59,47.62 53,49.21 v53,50.16 | R37.1 32.26,23.18 OK1.6 v38.08,23.18
MIDI_TX  (via drill 0.6)
  Top 0.254: UC1.30 25.95,74.05 29.67,70.33 33.48,70.33 39.35,64.45 47.92,64.45 52.68,59.69 52.68,51.12 51.73,50.16 v51.73,49.53 | R40.2 36.17,19.05 40.62,23.5 40.62,30.16 48.24,37.78 50.14,37.78 53.95,41.59 v53.95,44.13
  Bottom 0.254: v51.73,49.53 53.95,47.31 v53.95,44.13
N$1
  Top 0.254: DISP1.16 Q2.C
N$2
  Top 0.254: R29.2 21.57,51.33 C22.1 20.08,51.12 IC6.9 17.12,51.12 16.17,52.07 16.17,58.42 17.12,59.37 R20.1
N$3
  Top 0.254: DISP1.11 Q1.C
N$4  (via drill 0.6)
  Top 0.254: UC1.5 10.34,75.05 8.87,76.52 8.02,76.52 C7.2 7.81,76.52 7.28,76.52 5.69,78.11 v5.69,78.42
  Bottom 0.254: v5.69,78.42 Q3.2
N$5  (via drill 0.6)
  Top 0.254: UC1.6 8.2,74.55 C10.2 7.7,74.61 7.28,74.61 v5.69,76.2
  Bottom 0.254: Q3.1 v5.69,76.2
N$6
  Top 0.254: Q2.B 48.72,103.5 49.19,103.5 50.14,104.46 51.73,104.46 52.68,103.5 54.59,103.5 54.91,103.19 R9.2
N$7
  Top 0.254: Q1.B 35.86,104.46 36.17,104.78 R1.2
N$8
  Bottom 0.254: D3.C R35.1 45.48,26.14 45.06,25.72 OK1.2
N$9
  Bottom 0.254: X1.4 49.51,40.32 49.51,28.89 48.45,27.84 R35.2
N$10
  Top 0.254: R40.1 36.2,16.27 X2.5
N$11
  Top 0.254: DISP1.17 R7.2
N$12
  Bottom 0.254: D3.A 46.65,21.91 45.38,23.18 OK1.3 42.84,23.18 41.89,24.13 41.89,40.32 X1.5
N$13
  Top 0.254: R39.1 34.59,15.56 35.86,14.29 48.88,14.29 49.59,15 X2.4
N$14
  Top 0.254: IC7.4 11.41,39.05 9.5,40.96 R32.2
N$15
  Top 0.254: DISP1.12 R3.2
N$16
  Top 0.254: DISP1.10 R2.2
N$17
  Top 0.254: R10.2 DISP1.9
N$18
  Top 0.254: R11.2 DISP1.7
N$19
  Top 0.254: R16.2 DISP1.1
N$20
  Top 0.254: DISP1.18 R8.2
N$22
  Top 0.254: DISP1.15 R6.2
N$23
  Top 0.254: DISP1.14 R5.2
N$24
  Top 0.254: R12.2 DISP1.6
N$25
  Top 0.254: R13.2 DISP1.5
N$26
  Top 0.254: R14.2 DISP1.4
N$27
  Top 0.254: R15.2 DISP1.2
N$28
  Top 0.254: DISP1.13 R4.2
N$29
  Top 0.254: R34.2 9.5,32.07 10.14,32.7 13.95,32.7 14.9,33.66 IC8.4
N$30
  Top 0.254: R6.1 45.28,102.23 45.7,102.23 46.33,101.6 46.33,97.16 46.65,96.84 46.65,91.76 43.16,88.27 IC2.7
N$31  (via drill 0.6)
  Top 0.254: v50.14,95.25 IC3.14 | v45.7,93.66 45.28,93.24 IC2.9
  Bottom 0.254: v50.14,95.25 47.29,95.25 v45.7,93.66
N$32
  Top 0.254: R3.1 37.23,102.23 36.49,102.23 36.17,101.92 36.17,96.84 36.81,96.2 IC2.15
N$33
  Top 0.254: R2.1 32.26,102.55 31.41,102.55 31.09,102.23 31.09,97.16 32.68,95.57 32.68,93.98 33.63,93.03 33.63,90.49 35.54,88.58 IC2.1
N$34
  Top 0.254: R10.1 32.58,78.74 33.32,78.74 33.63,79.06 33.63,82.87 36.81,86.04 IC2.2
N$35
  Top 0.254: R11.1 37.23,78.74 36.81,78.74 36.17,79.38 36.17,84.45 36.81,85.09 37.44,85.09 38.08,85.72 IC2.3
N$36  (via drill 0.6)
  Top 0.254: v41.25,84.77 39.98,84.77 39.35,85.41 IC2.4 | v53.95,84.77 53.95,79.06 53.42,78.53 R16.1
  Bottom 0.254: v41.25,84.77 v53.95,84.77
N$37  (via drill 0.6)
  Top 0.203: 55.86,91.76 55.86,94.61
  Top 0.254: R8.1 52.79,102.55 53.32,102.55 53.95,101.92 53.95,97.16 55.86,95.25 55.86,94.61 | 55.86,91.76 56.18,91.44 v56.18,89.53 | IC2.5 40.62,88.58 v40.94,88.9
  Bottom 0.254: v56.18,89.53 55.86,89.85 54.91,89.85 53.95,90.81 48.88,90.81 47.92,89.85 41.89,89.85 v40.94,88.9
N$38  (via drill 0.6)
  Top 0.203: 43.79,91.76 43.79,94.93
  Top 0.254: v51.41,103.19 50.46,103.19 50.14,102.87 R7.1 | IC2.6 41.89,88.27 43.79,90.17 43.79,91.76 | 43.79,94.93 v43.79,101.6
  Bottom 0.254: v43.79,101.6 44.11,101.28 49.51,101.28 v51.41,103.19
N$39  (via drill 0.6)
  Top 0.254: R5.1 42.42,102.55 41.89,102.55 41.25,101.92 v41.25,99.69 | IC3.15 v48.88,99.69
  Bottom 0.254: v48.88,99.69 48.56,100.01 41.57,100.01 v41.25,99.69
N$40
  Top 0.254: R12.1 40.2,78.74 40.62,78.74 41.25,79.38 41.25,82.87 42.84,84.45 46.97,84.45 47.6,85.09 IC3.1
N$41
  Top 0.254: R13.1 42.74,78.74 43.16,78.74 43.79,79.38 43.79,83.19 44.43,83.82 47.29,83.82 48.88,85.41 IC3.2
N$42
  Top 0.254: R14.1 45.28,78.74 46.33,78.74 48.88,81.28 48.88,84.14 50.14,85.41 IC3.3
N$43
  Top 0.254: R15.1 50.36,78.74 50.78,78.74 51.41,79.38 IC3.4
N$44  (via drill 0.6)
  Top 0.203: 52.05,91.44 52.05,94.61
  Top 0.254: IC3.5 52.68,88.9 52.05,89.53 52.05,91.44 | 52.05,94.61 50.78,95.89 50.78,96.84 51.41,97.47 v51.41,99.69 | v38.71,101.6 38.71,101.92 39.25,102.45 R4.1
  Bottom 0.254: v51.41,99.69 50.46,100.65 39.67,100.65 v38.71,101.6
N$45
  Top 0.254: R38.2 9.5,16.51 10.78,15.24 IC10.4
N$46
  Top 0.254: R43.2 9.5,8.26 10.14,8.89 13.63,8.89 14.9,10.16 IC11.4
N$47
  Top 0.254: R24.2 8.82,58.48 C14.2 10.2,58.42 11.41,58.42 12.15,57.68 IC6.1
N$48
  Top 0.254: R38.1 9.61,19.37 10.46,19.37 11.41,18.41 J6.TIP
N$49
  Top 0.254: R43.1 9.72,5.71 10.46,5.71 11.09,6.35 J8.TIP
N$50
  Top 0.254: IC6.7 10.35,49.85 C21.2 8.98,49.63 R30.2
N$51
  Top 0.254: IC6.8 20.08,49.85 C22.2 21.57,49.63 R31.2
N$52
  Top 0.254: IC6.14 19.93,57.47 C16.2 21.62,57.84 R25.2
N$53
  Top 0.254: R24.1 R26.1 6.01,56.83 4.74,55.56 4.74,47.94 7.6,45.09 16.49,45.09 21.89,39.69 21.89,28.26 23.16,26.99 23.16,16.83 24.46,15.52 J7.TIP
N$54
  Top 0.254: R33.2 LED1.A
N$55
  Top 0.254: J3.TIP 24.46,39.65 22.84,41.27 22.84,43.81 23.37,44.35 R31.1 R29.1
N$56
  Top 0.406: JP2.2 JP2.1 18.71,104.14 D1.A
N$57
  Top 0.254: R34.1 9.61,29.53 10.46,29.53 11.41,30.48 J4.TIP
N$58
  Top 0.254: R25.1 R27.1 24.11,56.2 25.7,54.61 25.7,53.34 25.06,52.7 25.06,48.26 24.46,47.66 J1.TIP
N$59
  Top 0.254: R27.2 21.62,56.14 C16.1 20.24,56.2 IC6.13 17.12,56.2 16.81,56.52 16.81,58.1 17.12,58.42 18.39,58.42 18.71,58.74 R21.1 18.71,59.37
N$60
  Top 0.254: R19.1 15.54,59.37 14.27,58.1 14.27,52.07 13.31,51.12 IC6.6 10.35,51.12 C21.1 8.87,51.33 R28.2
N$61
  Top 0.254: 8.65,56.83 R26.2 8.82,56.78 C14.1 10.51,56.78 11.09,56.2 IC6.2 13.31,56.2 13.63,56.52 13.63,58.42 13.95,58.74 R18.1
N$63
  Top 0.254: J5.TIP 24.46,26.63 22.52,28.57 22.52,40.01 16.17,46.35 11.41,46.35 8.87,48.9 7.28,48.9 7.07,49.11 R30.1 R28.1
N$64
  Top 0.406: JP2.10 JP2.9 7.29,104.14 D2.C
N$65
  Top 0.254: LED2.A R36.2
N$66
  Top 0.254: LED3.A R41.2
N$67
  Top 0.254: R42.2 28.97,10.16 28.55,10.16 27.92,9.53 27.92,6.35 LED4.A
RESET  (via drill 0.6)
  Top 0.254: JP4.10 39.35,73.66 36.49,76.52 29.82,76.52 28.08,78.26 28.08,80.33 26.01,82.39 22.52,82.39 v21.89,81.76 | v19.03,76.83 16.24,74.05 UC1.7 12.75,74.05 12.2,73.5 11.31,73.5 R17.1
  Bottom 0.254: v21.89,81.76 19.03,78.9 v19.03,76.83
SWITCH_0  (via drill 0.6)
  Top 0.254: SW2.A1 SW2.A2 47.29,67.94 40.3,67.94 35.06,73.18 v31.25,73.18 | v20.62,75.25 19.35,75.25 16.64,72.55 UC1.15
  Bottom 0.254: v31.25,73.18 30.14,74.3 21.89,74.3 21.57,74.61 21.25,74.61 v20.62,75.25
SWITCH_1  (via drill 0.6)
  Top 0.254: SW3.A2 SW3.A1 | v19.66,73.82 18.71,73.82 17.14,72.25 UC1.16
  Bottom 0.254: SW3.A2 26.97,67.94 28.55,69.53 28.55,72.55 27.44,73.66 21.57,73.66 21.41,73.82 v19.66,73.82
SWITCH_2
  Top 0.254: SW4.A2 SW4.A1 11.73,67.94 14.9,67.94 16.14,69.19 UC1.14
VCC  (via drill 0.6)
  Top 0.406: IC9.3 12.61,26.5 C25.1 10.88,26.25 v10.77,26.35 | C19.1 9.5,53.02 v10.14,53.66 IC6.4 | v26.65,52.07 26.97,52.39 44.75,52.39 45.38,53.02 45.38,55.88 44.75,56.52 IC5.2 | v21.89,45.4 19.03,45.4 14.9,49.53 v14.9,50.16 | 21.57,99.06 6.96,99.06 4.74,96.84 v4.74,87 4.74,84.77 1.57,81.6 v1.57,66.67 | IC1.3 21.57,96.25 21.57,99.06 | D1.C 26.97,100.33 27.6,100.97 v28.55,100.97 27.28,99.69 23.47,99.69 22.84,99.06 21.57,99.06
  Bottom 0.406: 7.92,53.66 v10.14,53.66 | 7.92,53.66 1.57,53.66 | 1.57,53.66 1.57,37.78 10.77,28.57 v10.77,26.35 | 1.57,53.66 v1.57,66.67 | v14.9,50.16 9.5,50.16 7.92,51.75 7.92,53.66 | v26.65,52.07 24.11,49.53 24.11,47.62 v21.89,45.4 | v28.55,100.97 27.11,102.41 C1.+ | C12.+ 4.74,89.82 v4.74,87
VEE  (via drill 0.6)
  Top 0.406: v4.11,60.33 v11.09,60.33 | C20.2 20.93,53.02 v20.3,53.66 IC6.11 | v3.15,85.72 3.15,96.52 3.47,96.84 D2.A 3.47,98.42 v2.2,97.16
  Bottom 0.406: v3.15,85.72 3.15,61.28 v4.11,60.33 | v11.09,60.33 17.76,53.66 v20.3,53.66 | C3.- 2.52,94.01 2.2,94.33 v2.2,97.16
VREF
  Top 0.254: R23.2 29.93,60.96 31.41,60.96 32.68,59.69 32.68,57.15 32.38,56.84 IC4.3 29.23,56.84 C17.1
VREF/2  (via drill 0.6)
  Top 0.254: IC6.10 17.12,52.39 16.81,52.7 16.81,54.61 17.12,54.93 IC6.12 21.57,54.93 v21.89,54.61 | IC6.5 13.31,52.39 13.63,52.7 13.63,54.61 13.31,54.93 IC6.3 9.5,54.93 v9.19,55.24 | v22.52,63.18 22.52,62.55 23.47,61.59 25.06,61.59 27.5,59.16 R22.2 R23.1
  Bottom 0.254: v9.19,55.24 13,55.24 16.81,51.44 21.25,51.44 21.89,52.07 v21.89,54.61 21.89,61.91 21.89,62.55 v22.52,63.18

### Text on the board
tPlace: Red stripe | cc-by-sa Émilie Gillet, 2013. v0.3 | Yarns
bPlace: Yarns | cc-by-sa Émilie Gillet, 2013. v0.3
tNames: -12V | GND | +12V | mini JTAG
bValues: TAP | START/STOP | REC